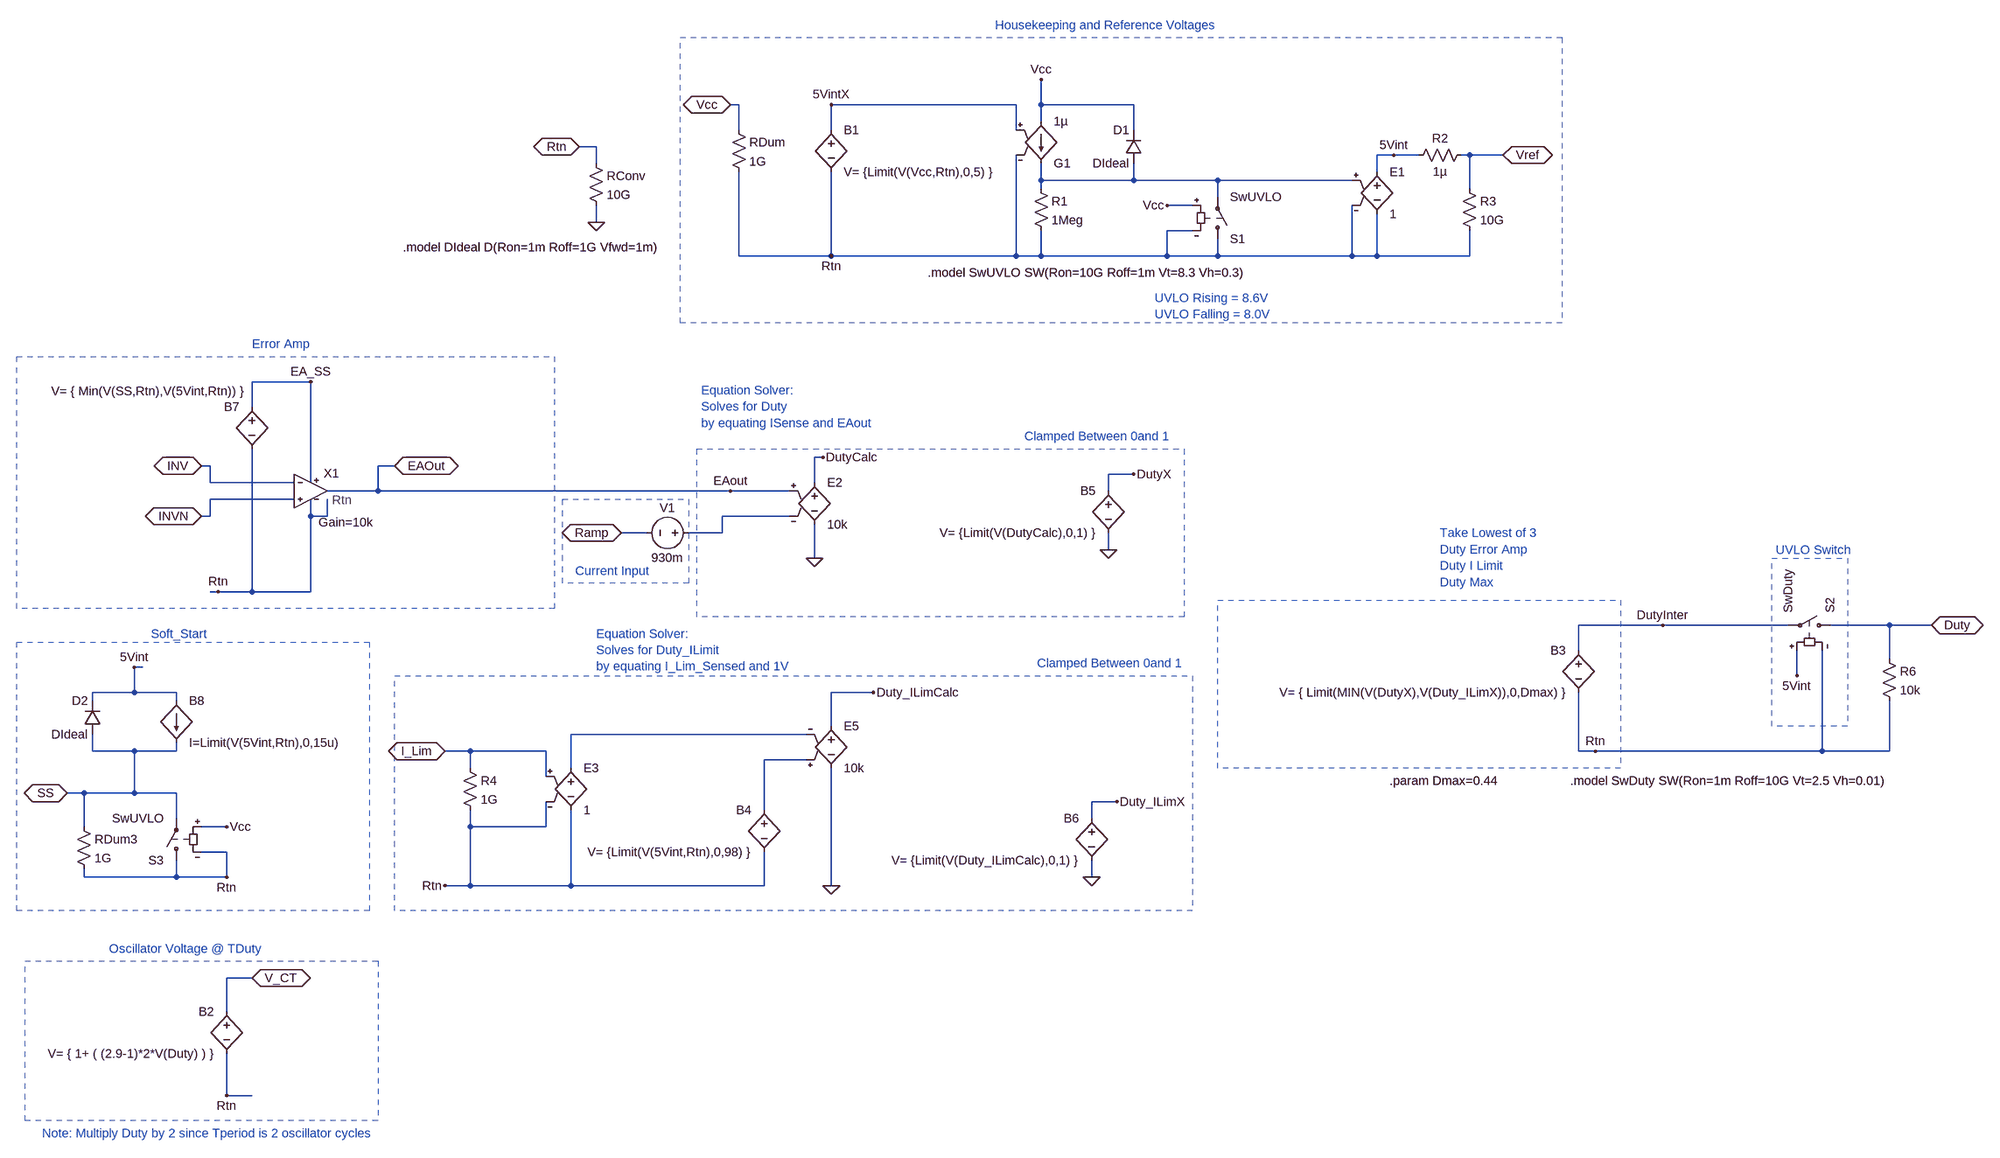
[diagram p0: schematic IS1825_Avg.asc]
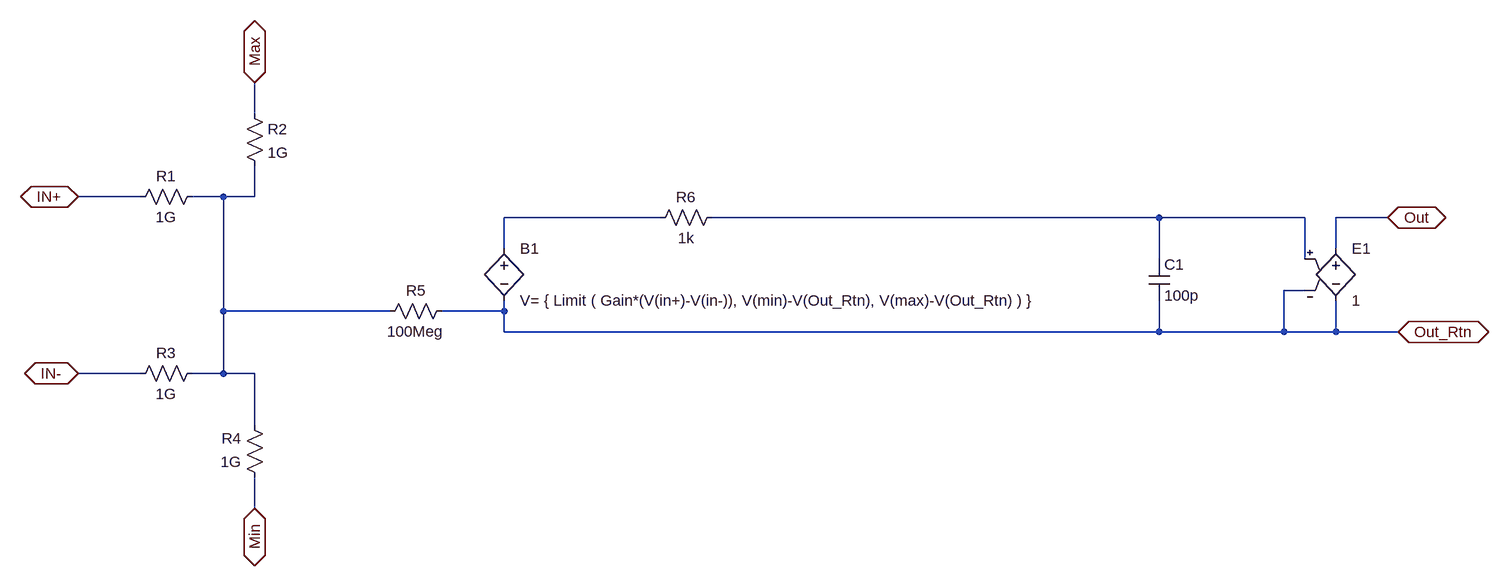
[diagram p1: sub-circuit voltage_amp.asc]
IS1825_Avg.asc, the LTspice schematic file:
Version 4.1
SHEET 1 2788 1936
WIRE 352 -48 336 -48
WIRE 880 -48 528 -48
WIRE 928 -48 928 -96
WIRE 1104 -48 928 -48
WIRE 928 -16 928 -48
WIRE 352 0 352 -48
WIRE 528 0 528 -48
WIRE 880 0 880 -48
WIRE 1104 0 1104 -48
WIRE 80 32 48 32
WIRE 1600 48 1568 48
WIRE 1648 48 1600 48
WIRE 1744 48 1728 48
WIRE 1808 48 1744 48
WIRE 80 64 80 32
WIRE 1568 80 1568 48
WIRE 928 96 928 64
WIRE 1104 96 1104 64
WIRE 1104 96 928 96
WIRE 1264 96 1104 96
WIRE 1520 96 1264 96
WIRE 928 112 928 96
WIRE 1744 112 1744 48
WIRE 1264 128 1264 96
WIRE 1216 144 1168 144
WIRE 80 176 80 144
WIRE 1216 192 1168 192
WIRE 352 240 352 80
WIRE 528 240 528 80
WIRE 528 240 352 240
WIRE 880 240 880 48
WIRE 880 240 528 240
WIRE 928 240 928 192
WIRE 928 240 880 240
WIRE 1168 240 1168 192
WIRE 1168 240 928 240
WIRE 1264 240 1264 208
WIRE 1264 240 1168 240
WIRE 1520 240 1520 144
WIRE 1520 240 1264 240
WIRE 1568 240 1568 160
WIRE 1568 240 1520 240
WIRE 1744 240 1744 192
WIRE 1744 240 1568 240
WIRE -464 480 -576 480
WIRE -576 528 -576 480
WIRE 512 624 496 624
WIRE -656 640 -672 640
WIRE -304 640 -336 640
WIRE 1104 656 1056 656
WIRE -656 672 -656 640
WIRE -496 672 -656 672
WIRE -464 672 -464 480
WIRE 496 672 496 624
WIRE -336 688 -336 640
WIRE -336 688 -432 688
WIRE 336 688 -336 688
WIRE 448 688 336 688
WIRE 1056 688 1056 656
WIRE -496 704 -656 704
WIRE -656 736 -656 704
WIRE -656 736 -672 736
WIRE -464 736 -464 704
WIRE -432 736 -432 704
WIRE -432 736 -464 736
WIRE 448 736 320 736
WIRE 176 768 128 768
WIRE 320 768 320 736
WIRE 320 768 256 768
WIRE 1056 800 1056 768
WIRE 496 816 496 752
WIRE -640 880 -656 880
WIRE -576 880 -576 608
WIRE -576 880 -640 880
WIRE -464 880 -464 736
WIRE -464 880 -576 880
WIRE 2112 944 1952 944
WIRE 2352 944 2112 944
WIRE 2544 944 2432 944
WIRE 2624 944 2544 944
WIRE 1952 992 1952 944
WIRE 2544 1008 2544 944
WIRE -784 1024 -800 1024
WIRE 2368 1040 2368 992
WIRE -800 1072 -800 1024
WIRE -800 1072 -880 1072
WIRE -720 1072 -800 1072
WIRE 608 1072 528 1072
WIRE -880 1088 -880 1072
WIRE -720 1088 -720 1072
WIRE 528 1136 528 1072
WIRE 480 1152 32 1152
WIRE -880 1184 -880 1152
WIRE -800 1184 -880 1184
WIRE -720 1184 -720 1168
WIRE -720 1184 -800 1184
WIRE -160 1184 -208 1184
WIRE -16 1184 -160 1184
WIRE 1952 1184 1952 1072
WIRE 1984 1184 1952 1184
WIRE 2416 1184 2416 992
WIRE 2416 1184 1984 1184
WIRE 2544 1184 2544 1088
WIRE 2544 1184 2416 1184
WIRE 480 1200 400 1200
WIRE -160 1216 -160 1184
WIRE 32 1216 32 1152
WIRE -16 1232 -16 1184
WIRE -896 1264 -928 1264
WIRE -800 1264 -800 1184
WIRE -800 1264 -896 1264
WIRE -720 1264 -800 1264
WIRE 1072 1280 1024 1280
WIRE 400 1296 400 1200
WIRE -720 1312 -720 1264
WIRE 1024 1312 1024 1280
WIRE -896 1328 -896 1264
WIRE -624 1328 -672 1328
WIRE -160 1328 -160 1296
WIRE -16 1328 -16 1280
WIRE -16 1328 -160 1328
WIRE -624 1376 -672 1376
WIRE -896 1424 -896 1408
WIRE -720 1424 -720 1392
WIRE -720 1424 -896 1424
WIRE -624 1424 -624 1376
WIRE -624 1424 -720 1424
WIRE 1024 1424 1024 1392
WIRE -160 1440 -160 1328
WIRE -160 1440 -208 1440
WIRE 32 1440 32 1296
WIRE 32 1440 -160 1440
WIRE 400 1440 400 1376
WIRE 400 1440 32 1440
WIRE 528 1440 528 1216
WIRE -576 1616 -624 1616
WIRE -624 1680 -624 1616
WIRE -624 1840 -624 1760
WIRE -576 1840 -624 1840
FLAG 80 176 0
FLAG 48 32 Rtn
IOPIN 48 32 BiDir
FLAG 336 -48 Vcc
IOPIN 336 -48 BiDir
FLAG 528 240 Rtn
FLAG 528 -48 5VintX
FLAG 928 -96 Vcc
FLAG 1168 144 Vcc
FLAG 1600 48 5Vint
FLAG 1808 48 Vref
IOPIN 1808 48 BiDir
FLAG -640 880 Rtn
FLAG -672 640 INV
IOPIN -672 640 BiDir
FLAG 336 688 EAout
FLAG 128 768 Ramp
IOPIN 128 768 BiDir
FLAG 512 624 DutyCalc
FLAG 496 816 0
FLAG 2368 1040 5Vint
FLAG 2624 944 Duty
IOPIN 2624 944 BiDir
FLAG -672 736 INVN
IOPIN -672 736 BiDir
FLAG -304 640 EAOut
IOPIN -304 640 BiDir
FLAG -624 1840 Rtn
FLAG -576 1616 V_CT
IOPIN -576 1616 BiDir
FLAG -208 1184 I_Lim
IOPIN -208 1184 BiDir
FLAG -208 1440 Rtn
FLAG 528 1440 0
FLAG 608 1072 Duty_ILimCalc
FLAG 1056 800 0
FLAG 1104 656 DutyX
FLAG 1024 1424 0
FLAG 1072 1280 Duty_ILimX
FLAG -464 480 EA_SS
FLAG -624 1328 Vcc
FLAG -800 1024 5Vint
FLAG -928 1264 SS
IOPIN -928 1264 BiDir
FLAG -624 1424 Rtn
FLAG 1984 1184 Rtn
FLAG 2112 944 DutyInter
SYMBOL res 336 -16 R0
SYMATTR InstName RDum
SYMATTR Value 1G
SYMBOL res 64 48 R0
SYMATTR InstName RConv
SYMATTR Value 10G
SYMBOL bv 528 -16 R0
SYMATTR InstName B1
SYMATTR Value V= {Limit(V(Vcc,Rtn),0,5) }
SYMBOL res 912 96 R0
SYMATTR InstName R1
SYMATTR Value 1Meg
SYMBOL g2 928 80 M180
SYMATTR InstName G1
SYMATTR Value 1µ
SYMBOL diode 1120 64 R180
WINDOW 0 24 64 Left 2
WINDOW 3 24 0 Left 2
SYMATTR InstName D1
SYMATTR Value DIdeal
SYMBOL sw 1264 224 M180
SYMATTR InstName S1
SYMATTR Value SwUVLO
SYMBOL e 1568 64 R0
SYMATTR InstName E1
SYMATTR Value 1
SYMBOL res 1744 32 R90
WINDOW 0 0 56 VBottom 2
WINDOW 3 32 56 VTop 2
SYMATTR InstName R2
SYMATTR Value 1µ
SYMBOL res 1728 96 R0
SYMATTR InstName R3
SYMATTR Value 10G
SYMBOL e 496 656 R0
SYMATTR InstName E2
SYMATTR Value 10k
SYMBOL bv 1952 976 M0
SYMATTR InstName B3
SYMATTR Value V= { Limit(MIN(V(DutyX),V(Duty_ILimX)),0,Dmax) }
SYMBOL sw 2448 944 M270
SYMATTR InstName S2
SYMATTR Value SwDuty
SYMBOL res 2528 992 R0
SYMATTR InstName R6
SYMATTR Value 10k
SYMBOL voltage 272 768 R90
WINDOW 0 -32 56 VBottom 2
WINDOW 3 32 56 VTop 2
WINDOW 123 0 0 Left 0
WINDOW 39 0 0 Left 0
SYMATTR InstName V1
SYMATTR Value 930m
SYMBOL bv -624 1664 M0
SYMATTR InstName B2
SYMATTR Value V= { 1+ ( (2.9-1)*2*V(Duty) ) }
SYMBOL res -176 1200 R0
SYMATTR InstName R4
SYMATTR Value 1G
SYMBOL e 32 1200 R0
SYMATTR InstName E3
SYMATTR Value 1
SYMBOL e2 528 1120 R0
SYMATTR InstName E5
SYMATTR Value 10k
SYMBOL bv 400 1280 M0
SYMATTR InstName B4
SYMATTR Value V= {Limit(V(5Vint,Rtn),0,98) }
SYMBOL bv 1056 672 M0
SYMATTR InstName B5
SYMATTR Value V= {Limit(V(DutyCalc),0,1) }
SYMBOL bv 1024 1296 M0
SYMATTR InstName B6
SYMATTR Value V= {Limit(V(Duty_ILimCalc),0,1) }
SYMBOL bv -576 512 M0
WINDOW 3 14 -14 Left 2
SYMATTR Value V= { Min(V(SS,Rtn),V(5Vint,Rtn)) }
SYMATTR InstName B7
SYMBOL sw -720 1408 R180
SYMATTR InstName S3
SYMATTR Value SwUVLO
SYMBOL bi -720 1088 R0
SYMATTR InstName B8
SYMATTR Value I=Limit(V(5Vint,Rtn),0,15u)
SYMBOL diode -864 1152 R180
WINDOW 0 24 64 Left 2
WINDOW 3 24 0 Left 2
SYMATTR InstName D2
SYMATTR Value DIdeal
SYMBOL res -912 1312 R0
SYMATTR InstName RDum3
SYMATTR Value 1G
SYMBOL Voltage_Amp -480 688 R0
WINDOW 0 56 -18 Bottom 2
WINDOW 39 83 75 Bottom 2
SYMATTR InstName X1
SYMATTR SpiceLine Gain=10k
TEXT -288 224 Left 2 !.model DIdeal D(Ron=1m Roff=1G Vfwd=1m)
TEXT 712 272 Left 2 !.model SwUVLO SW(Ron=10G Roff=1m Vt=8.3 Vh=0.3)
TEXT 1144 320 Left 2 ;UVLO Rising = 8.6V\nUVLO Falling = 8.0V
TEXT 1936 1240 Left 2 !.model SwDuty SW(Ron=1m Roff=10G Vt=2.5 Vh=0.01)
TEXT 280 496 Left 2 ;Equation Solver:\nSolves for Duty\nby equating ISense and EAout
TEXT 1688 768 Left 2 ;Take Lowest of 3\nDuty Error Amp\nDuty I Limit\nDuty Max
TEXT 2328 800 Left 2 ;UVLO Switch
TEXT 1592 1240 Left 2 !.param Dmax=0.44
TEXT -768 960 Left 2 ;Soft_Start
TEXT -848 1560 Left 2 ;Oscillator Voltage @ TDuty
TEXT 840 -200 Left 2 ;Housekeeping and Reference Voltages
TEXT 896 584 Left 2 ;Clamped Between 0and 1
TEXT 80 960 Left 2 ;Equation Solver:\nSolves for Duty_ILimit\nby equating I_Lim_Sensed and 1V
TEXT 920 1016 Left 2 ;Clamped Between 0and 1
TEXT -576 408 Left 2 ;Error Amp
TEXT 40 840 Left 2 ;Current Input
TEXT -976 1912 Left 2 ;Note: Multiply Duty by 2 since Tperiod is 2 oscillator cycles
RECTANGLE Normal 1920 368 240 -176 2
RECTANGLE Normal 0 912 -1024 432 2
RECTANGLE Normal 1200 928 272 608 2
RECTANGLE Normal 2032 1216 1264 896 2
RECTANGLE Normal 2464 1136 2320 816 2
RECTANGLE Normal -352 1488 -1024 976 2
RECTANGLE Normal -336 1888 -1008 1584 2
RECTANGLE Normal 1216 1488 -304 1040 2
RECTANGLE Normal 256 864 16 704 2

voltage_amp.asc, the sub-circuit schematic file:
Version 4.1
SHEET 1 2092 680
WIRE 176 -80 176 -128
WIRE 0 48 -96 48
WIRE 128 48 80 48
WIRE 176 48 176 0
WIRE 176 48 128 48
WIRE 800 80 560 80
WIRE 1568 80 880 80
WIRE 1792 80 1568 80
WIRE 1920 80 1840 80
WIRE 560 128 560 80
WIRE 1840 128 1840 80
WIRE 1568 144 1568 80
WIRE 1792 144 1792 80
WIRE 1792 192 1760 192
WIRE 128 224 128 48
WIRE 384 224 128 224
WIRE 560 224 560 208
WIRE 560 224 464 224
WIRE 560 256 560 224
WIRE 1568 256 1568 208
WIRE 1568 256 560 256
WIRE 1760 256 1760 192
WIRE 1760 256 1568 256
WIRE 1840 256 1840 208
WIRE 1840 256 1760 256
WIRE 1936 256 1840 256
WIRE 0 320 -96 320
WIRE 128 320 128 224
WIRE 128 320 80 320
WIRE 176 320 128 320
WIRE 176 400 176 320
WIRE 176 528 176 480
FLAG 176 -128 Max
IOPIN 176 -128 BiDir
FLAG -96 320 IN-
IOPIN -96 320 BiDir
FLAG 176 528 Min
IOPIN 176 528 BiDir
FLAG -96 48 IN+
IOPIN -96 48 BiDir
FLAG 1920 80 Out
IOPIN 1920 80 BiDir
FLAG 1936 256 Out_Rtn
IOPIN 1936 256 BiDir
SYMBOL res 96 32 R90
WINDOW 0 0 56 VBottom 2
WINDOW 3 32 56 VTop 2
SYMATTR InstName R1
SYMATTR Value 1G
SYMBOL res 160 -96 R0
SYMATTR InstName R2
SYMATTR Value 1G
SYMBOL res 96 304 R90
WINDOW 0 0 56 VBottom 2
WINDOW 3 32 56 VTop 2
SYMATTR InstName R3
SYMATTR Value 1G
SYMBOL res 192 496 R180
WINDOW 0 36 76 Left 2
WINDOW 3 36 40 Left 2
SYMATTR InstName R4
SYMATTR Value 1G
SYMBOL res 480 208 R90
WINDOW 0 0 56 VBottom 2
WINDOW 3 32 56 VTop 2
SYMATTR InstName R5
SYMATTR Value 100Meg
SYMBOL bv 560 112 R0
SYMATTR InstName B1
SYMATTR Value V= { Limit ( Gain*(V(in+)-V(in-)), V(min)-V(Out_Rtn), V(max)-V(Out_Rtn) ) }
SYMBOL res 896 64 R90
WINDOW 0 0 56 VBottom 2
WINDOW 3 32 56 VTop 2
SYMATTR InstName R6
SYMATTR Value 1k
SYMBOL cap 1552 144 R0
SYMATTR InstName C1
SYMATTR Value 100p
SYMBOL e 1840 112 R0
SYMATTR InstName E1
SYMATTR Value 1

The netlist it stands for:
* IS1825_Avg.asc
RDum Vcc Rtn 1G
RConv Rtn 0 10G
B1 5VintX Rtn V= {Limit(V(Vcc,Rtn),0,5) }
R1 N001 Rtn 1Meg
G1 Vcc N001 5VintX Rtn 1µ
D1 N001 Vcc DIdeal
S1 Rtn N001 Vcc Rtn SwUVLO
E1 5Vint Rtn N001 Rtn 1
R2 Vref 5Vint 1µ
R3 Vref Rtn 10G
E2 DutyCalc 0 EAout N002 10k
B3 DutyInter Rtn V= { Limit(MIN(V(DutyX),V(Duty_ILimX)),0,Dmax) }
S2 Duty DutyInter 5Vint Rtn SwDuty
R6 Duty Rtn 10k
V1 N002 Ramp 930m
B2 V_CT Rtn V= { 1+ ( (2.9-1)*2*V(Duty) ) }
R4 I_Lim Rtn 1G
E3 N003 Rtn I_Lim Rtn 1
E5 Duty_ILimCalc 0 N004 N003 10k
B4 N004 Rtn V= {Limit(V(5Vint,Rtn),0,98) }
B5 DutyX 0 V= {Limit(V(DutyCalc),0,1) }
B6 Duty_ILimX 0 V= {Limit(V(Duty_ILimCalc),0,1) }
B7 EA_SS Rtn V= { Min(V(SS,Rtn),V(5Vint,Rtn)) }
S3 Rtn SS Vcc Rtn SwUVLO
B8 5Vint SS I=Limit(V(5Vint,Rtn),0,15u)
D2 SS 5Vint DIdeal
RDum3 SS Rtn 1G
X§X1 INVN INV EA_SS Rtn EAout Rtn voltage_amp params: Gain=10k

* block symbol definitions
.subckt voltage_amp IN+ IN- Max Min Out Out_Rtn
R1 N001 IN+ 1G
R2 Max N001 1G
R3 N001 IN- 1G
R4 Min N001 1G
R5 Out_Rtn N001 100Meg
B1 N002 Out_Rtn V= { Limit ( Gain*(V(in+)-V(in-)), V(min)-V(Out_Rtn), V(max)-V(Out_Rtn) ) }
R6 N003 N002 1k
C1 N003 Out_Rtn 100p
E1 Out Out_Rtn N003 Out_Rtn 1
.ends voltage_amp

.model D D
.lib standard.dio
.model DIdeal D(Ron=1m Roff=1G Vfwd=1m)
.model SwUVLO SW(Ron=10G Roff=1m Vt=8.3 Vh=0.3)
* UVLO Rising = 8.6V
* UVLO Falling = 8.0V
.model SwDuty SW(Ron=1m Roff=10G Vt=2.5 Vh=0.01)
* Equation Solver:
* Solves for Duty
* by equating ISense and EAout
* Take Lowest of 3
* Duty Error Amp
* Duty I Limit
* Duty Max
* UVLO Switch
.param Dmax=0.44
* Soft_Start
* Oscillator Voltage @ TDuty
* Housekeeping and Reference Voltages
* Clamped Between 0and 1
* Equation Solver:
* Solves for Duty_ILimit
* by equating I_Lim_Sensed and 1V
* Clamped Between 0and 1
* Error Amp
* Current Input
* Note: Multiply Duty by 2 since Tperiod is 2 oscillator cycles
.backanno
.end